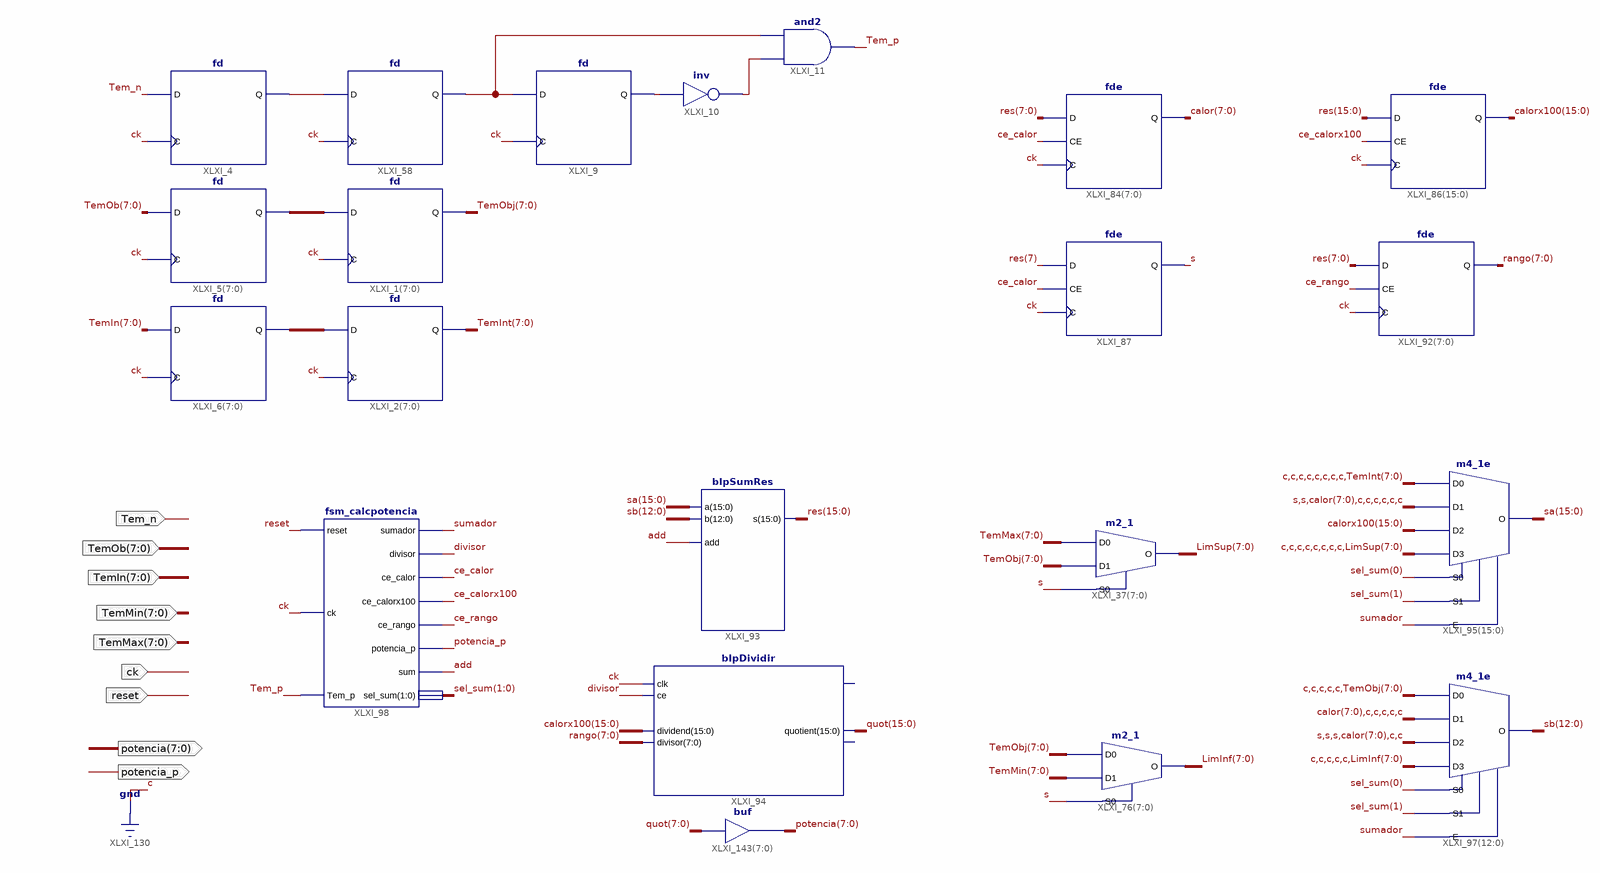
[diagram p0: schematic sheet 1]
// Xilinx ISE schematic calc_potencia.sch (spartan6) as structural Verilog: 21 symbols, 9 ports
module calc_potencia (
  input  [7:0] TemOb,
  input  [7:0] TemIn,
  input  ck,
  input  [7:0] TemMin,
  input  Tem_n,
  input  [7:0] TemMax,
  input  reset,
  output [7:0] potencia,
  output potencia_p
);

  wire add, ce_calor, ce_calorx100, ce_rango, divisor, s, sumador, Tem_p, XLXN_38, XLXN_42, XLXN_70, XLXN_105;
  wire [1:0] sel_sum;
  wire [7:0] calor, LimInf, LimSup, rango, TemInt, TemObj, XLXN_12, XLXN_14;
  wire [12:0] sb;
  wire [15:0] calorx100, quot, res, sa;

  fde XLXI_87 (.C(ck), .CE(ce_calor), .D(res[7]), .Q(s));
  fde XLXI_84[7:0] (.C(ck), .CE(ce_calor), .D(res[7:0]), .Q(calor));
  fde XLXI_86[15:0] (.C(ck), .CE(ce_calorx100), .D(res), .Q(calorx100));
  fde XLXI_92[7:0] (.C(ck), .CE(ce_rango), .D(res[7:0]), .Q(rango));
  m4_1e XLXI_95[15:0] (
    .D0({{8{1'b0}}, TemInt}), .D1({{2{s}}, calor, {6{1'b0}}}), .D2(calorx100), .D3({{8{1'b0}}, LimSup}),
    .E(sumador), .S0(sel_sum[0]), .S1(sel_sum[1]), .O(sa));
  m2_1 XLXI_37[7:0] (.D0(TemMax), .D1(TemObj), .S0(s), .O(LimSup));
  m2_1 XLXI_76[7:0] (.D0(TemObj), .D1(TemMin), .S0(s), .O(LimInf));
  m4_1e XLXI_97[12:0] (
    .D0({{5{1'b0}}, TemObj}), .D1({calor, {5{1'b0}}}), .D2({{3{s}}, calor, 2'b00}), .D3({{5{1'b0}}, LimInf}),
    .E(sumador), .S0(sel_sum[0]), .S1(sel_sum[1]), .O(sb));
  fd XLXI_5[7:0] (.C(ck), .D(TemOb), .Q(XLXN_12));
  fd XLXI_1[7:0] (.C(ck), .D(XLXN_12), .Q(TemObj));
  fd XLXI_6[7:0] (.C(ck), .D(TemIn), .Q(XLXN_14));
  fd XLXI_2[7:0] (.C(ck), .D(XLXN_14), .Q(TemInt));
  fd XLXI_4 (.C(ck), .D(Tem_n), .Q(XLXN_105));
  fd XLXI_58 (.C(ck), .D(XLXN_105), .Q(XLXN_42));
  and XLXI_11 (Tem_p, XLXN_70, XLXN_42);
  not XLXI_10 (XLXN_70, XLXN_38);
  fd XLXI_9 (.C(ck), .D(XLXN_42), .Q(XLXN_38));
  bIpSumRes XLXI_93 (.a(sa), .b(sb), .add(add), .s(res));
  assign potencia = quot[7:0];  // buf XLXI_143[7..0], 8 bits wide
  fsm_calcpotencia XLXI_98 (
    .reset(reset), .ck(ck), .Tem_p(Tem_p), .sumador(sumador), .divisor(divisor), .ce_calor(ce_calor),
    .ce_calorx100(ce_calorx100), .ce_rango(ce_rango), .potencia_p(potencia_p), .sum(add), .sel_sum(sel_sum));
  bIpDividir XLXI_94 (
    .clk(ck), .ce(divisor), .dividend(calorx100), .divisor(rango), .quotient(quot));  // open: rfd, fractional
endmodule
